# EAGLE design RH022.1 (EAGLE 7.1.0)
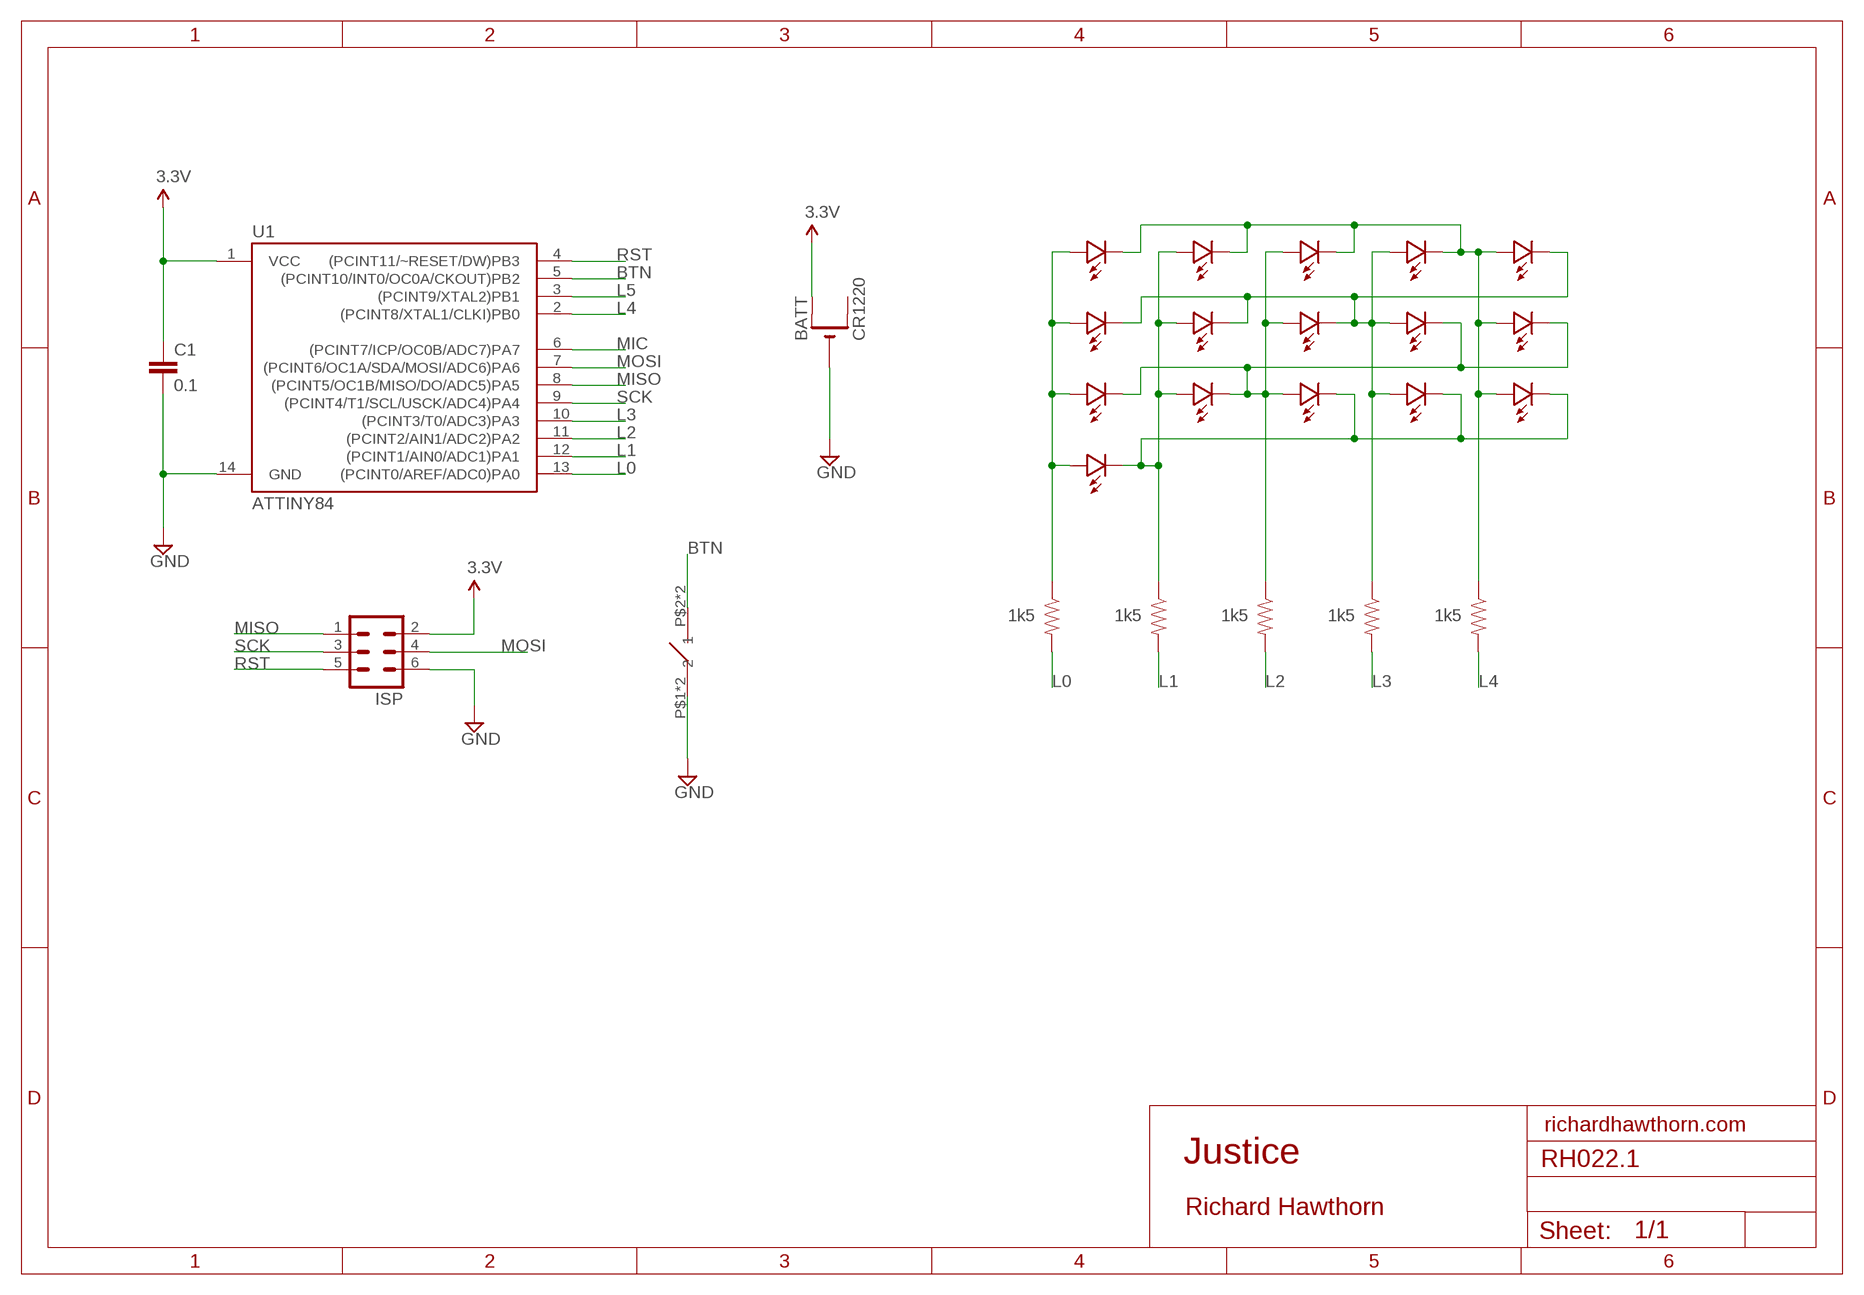
[diagram p0: schematic, sheet 1]

## Parts
BATT  CR1220  CR1220SMT  [CR1220-SMD]
BTN1  TURTLE-3PIN  [TURTLE-3PIN]
C1  0.1  CAP0603-CAP  [0603-CAP]
ISP  MA03-2  [MA03-2]
LED1  LED0603  [0603-LED]
LED2  LED0603  [0603-LED]
LED3  LED0603  [0603-LED]
LED4  LED0603  [0603-LED]
LED5  LED0603  [0603-LED]
LED6  LED0603  [0603-LED]
LED7  LED0603  [0603-LED]
LED8  LED0603  [0603-LED]
LED9  LED0603  [0603-LED]
LED10  LED0603  [0603-LED]
LED11  LED0603  [0603-LED]
LED12  LED0603  [0603-LED]
LED13  LED0603  [0603-LED]
LED14  LED0603  [0603-LED]
LED15  LED0603  [0603-LED]
LED16  LED0603  [0603-LED]
R1  1k5  RESISTOR0603-RES  [0603-RES]
R2  1k5  RESISTOR0603-RES  [0603-RES]
R3  1k5  RESISTOR0603-RES  [0603-RES]
R4  1k5  RESISTOR0603-RES  [0603-RES]
R5  1k5  RESISTOR0603-RES  [0603-RES]
U1  ATTINY84  [SO14]

## Nets
BTN: BTN1.P$2 BTN1.P$4 U1.5((PCINT10/INT0/OC0A/CKOUT)PB2)
GND [power]: BATT.- BTN1.P$1 BTN1.P$3 C1.2 ISP.6 U1.14(GND)
L0: R1.2 U1.13((PCINT0/AREF/ADC0)PA0)
L1: R2.2 U1.12((PCINT1/AIN0/ADC1)PA1)
L2: R3.2 U1.11((PCINT2/AIN1/ADC2)PA2)
L3: R4.2 U1.10((PCINT3/T0/ADC3)PA3)
L4: R5.2 U1.2((PCINT8/XTAL1/CLKI)PB0)
L5: U1.3((PCINT9/XTAL2)PB1)
MIC: U1.6((PCINT7/ICP/OC0B/ADC7)PA7)
MISO: ISP.1 U1.8((PCINT5/OC1B/MISO/DO/ADC5)PA5)
MOSI: ISP.4 U1.7((PCINT6/OC1A/SDA/MOSI/ADC6)PA6)
N$12: LED2.PLUS LED7.PLUS LED12.PLUS LED13.MINUS LED14.MINUS LED15.MINUS LED16.MINUS R2.1
N$22: LED1.PLUS LED6.PLUS LED11.PLUS LED16.PLUS R1.1
N$32: LED1.MINUS LED2.MINUS LED3.MINUS LED4.MINUS LED5.PLUS LED10.PLUS LED15.PLUS R5.1
N$41: LED4.PLUS LED5.MINUS LED6.MINUS LED7.MINUS LED8.MINUS LED9.PLUS LED14.PLUS R4.1
N$50: LED3.PLUS LED8.PLUS LED9.MINUS LED10.MINUS LED11.MINUS LED12.MINUS LED13.PLUS R3.1
RST: ISP.5 U1.4((PCINT11/~RESET/DW)PB3)
SCK: ISP.3 U1.9((PCINT4/T1/SCL/USCK/ADC4)PA4)
VCC: BATT.+$1(+) C1.1 ISP.2 U1.1(VCC) ; supply symbol labelled 3.3V
Unconnected: BATT.+$2(+1)

## Notes on the sheet
- richardhawthorn.com
- Justice
- Richard Hawthorn

## Library data of the parts
BATT = adafruit:CR1220: CR1216/CR1220/CR1225 12mm 3V lithium coin cell Great for battery packup. Both SMT and THM holders. Note the THM package has the ground pads on both sides of the PCB so that the masks are the same - this reduces the cost
BTN1 = Richards:TURTLE-3PIN
C1 = LowPowerLab:CAP: Capacitor Standard 0603 ceramic capacitor, and 0.1" leaded capacitor.
ISP = Richards:MA03-2: PIN HEADER; OC_FARNELL: unknown; OC_NEWARK: unknown
LED1-LED16 = LowPowerLab:LED
R1-R5 = LowPowerLab:RESISTOR: Resistor Basic schematic elements and footprints for 0603, 1206, and PTH resistors.
U1 = SparkFun-DigitalIC:ATTINY84: Atmel 14-pin 2/4/8kB flash uC

## Net classes
1 power: width 0.381 mm, clearance 0.254 mm

## Board
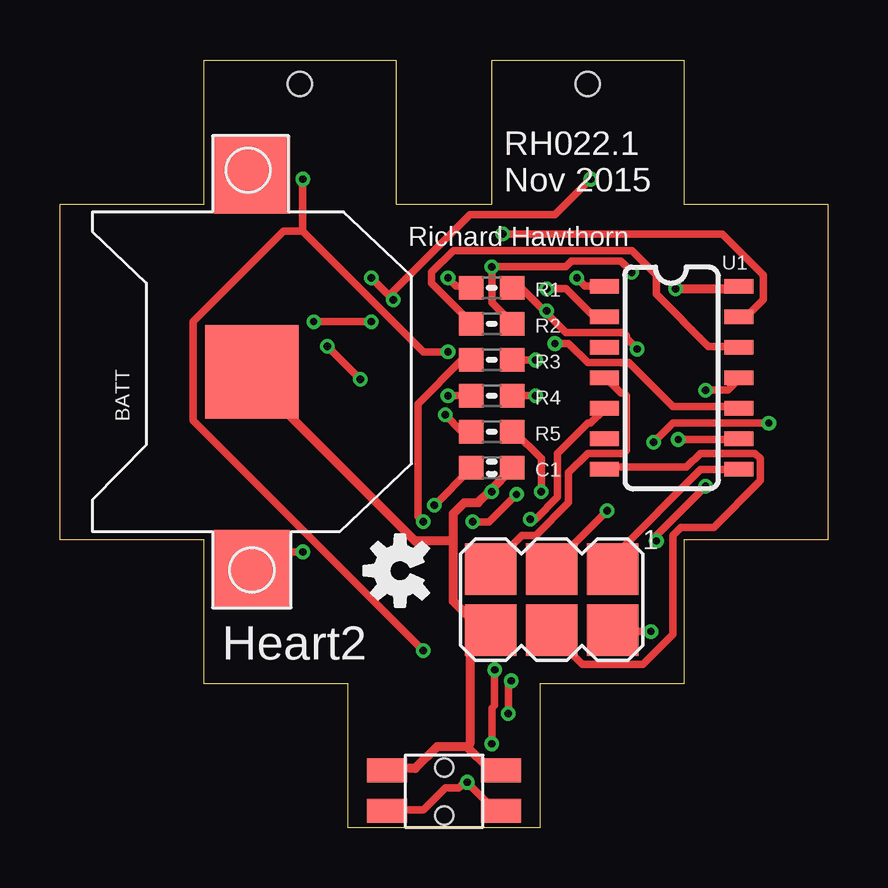
[diagram p1: board, top side]
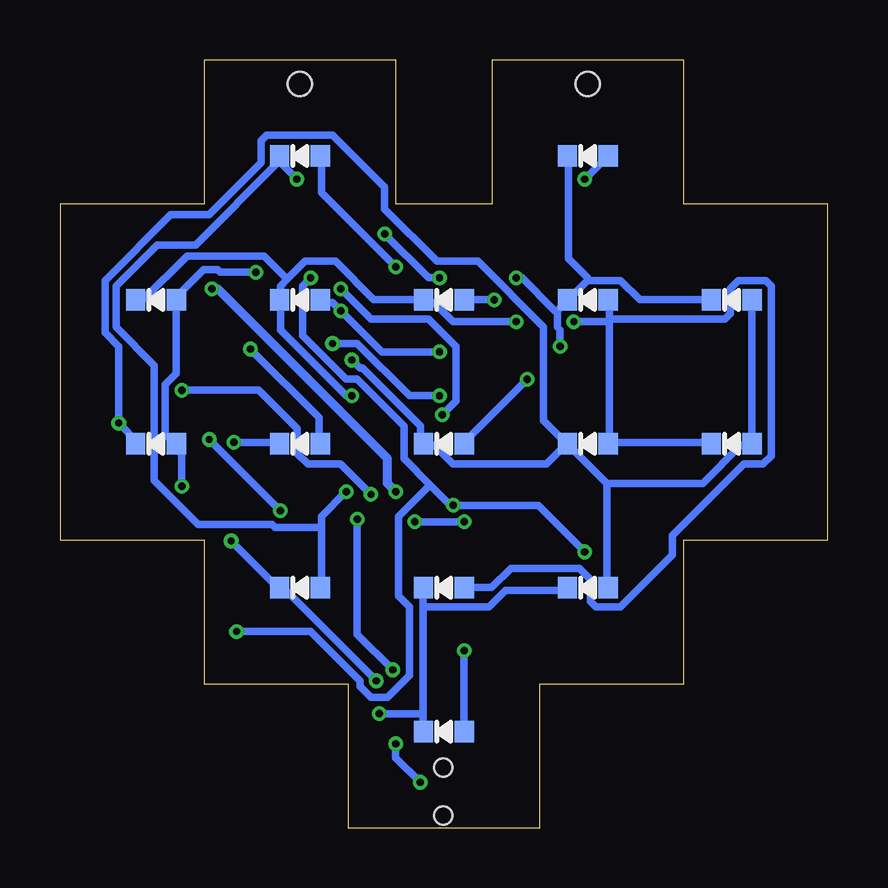
[diagram p2: board, bottom side, seen from below]

Size 32 x 32 mm. Coordinates in mm from the lower left corner, seen from the top.
Outline: 6,26 6,32 14,32 14,26 18,26 18,32 26,32 26,26 32,26 32,12 26,12 26,6 20,6 20,0 12,0 12,6 6,6 6,12 0,12 0,26 6,26
Copper layers (1*16): Top 0.035mm / dielectric 1.5mm / Bottom 0.035mm
Design rules "ITEADstudio_DRC *": minimum track width 12mil, minimum drill 12mil, track to track 6mil, track to pad 6mil, pad to pad 6mil, via to via 6mil, smd to smd 0mil, copper to edge 10mil, drill to drill 10mil, minimum pad ring 10mil, minimum via ring 6mil, stop-mask expansion 2mil, vias tented up to drill 100mil, thermal gap 15mil
Holes 1 mm at 22,31 10,31
tRestrict: area -5.7,-5.1 to -0.9,-1.2; area -24.2,2.9 to -23.1,4.5; area -24.8,-4.3 to -23.3,-3.6
bRestrict: area -2.6,3.7 to -0.8,4.7; area -8.9,-0.2 to -7.1,0.9; area -8.4,-1.4 to -7.9,-0.8; area -9.3,-1.4 to -8.8,-0.8; area -9.8,-1.2 to -9.3,-0.5; area -9.9,-0.6 to -9.4,0; area -3.5,4.9 to -2.9,5.5; area -3.5,3.9 to -2.9,4.5; area -2.5,5.1 to -2,5.8; area -2.1,4.8 to -0.9,5.6

### Footprints (pad centres in the part's own frame; a part is rotated, then mirrored left to right if it is on the bottom)
CR1220-SMD = smd 3.2 x 3.2: +$1 -8.2,0; +$2 8.2,0 | smd 3.9 x 3.9: - 0,0
TURTLE-3PIN = smd 1.676 x 1: P$1 -2.39,-0.889; P$2 -2.39,0.811; P$3 2.36,-0.889; P$4 2.36,0.811 | hole 0.75: -0.015,-1; -0.015,1
0603-CAP = smd 1.016 x 0.965: 1 -0.85,0; 2 0.85,0
MA03-2 = smd 2.159 x 2.159: 1 -2.54,-1.27; 2 -2.54,1.27; 3 0,-1.27; 4 0,1.27; 5 2.54,-1.27; 6 2.54,1.27
0603-LED = smd 0.8 x 0.9: MINUS -0.85,0; PLUS 0.85,0
0603-RES = smd 1.016 x 0.965: 1 -0.85,0; 2 0.85,0
SO14 = smd 0.6 x 1.2: 1 -3.81,-2.8; 2 -2.54,-2.8; 3 -1.27,-2.8; 4 0,-2.8; 5 1.27,-2.8; 6 2.54,-2.8; 7 3.81,-2.8; 8 3.81,2.8; 9 2.54,2.8; 10 1.27,2.8; 11 0,2.8; 12 -1.27,2.8; 13 -2.54,2.8; 14 -3.81,2.8

### Placement (x,y rotation side)
BATT  8,19 90 top
BTN1  16,1.5 180 top
C1  18,15 0 top
ISP  20.5,9.5 180 top
LED1  10,28 0 bottom
LED2  22,28 0 bottom
LED3  4,22 0 bottom
LED4  10,22 0 bottom
LED5  16,22 0 bottom
LED6  22,22 0 bottom
LED7  28,22 0 bottom
LED8  4,16 0 bottom
LED9  10,16 0 bottom
LED10  16,16 0 bottom
LED11  22,16 0 bottom
LED12  28,16 0 bottom
LED13  10,10 0 bottom
LED14  16,10 0 bottom
LED15  22,10 0 bottom
LED16  16,4 0 bottom
R1  18,22.5 180 top
R2  18,21 180 top
R3  18,19.5 180 top
R4  18,18 180 top
R5  18,16.5 180 top
U1  25.5,18.75 270 top
U$3  [OSHW-LOGO-S]  14.17,10.71 90 top

### Tracks (layer width: path | path; a pad name or v marks a point on that pad's centre or on a via)
BTN  (via drill 0.3)
  Top 0.305: v19.61,12.86 19.84,12.86 20.75,13.77 20.75,15.6 22.01,16.86 22.12,16.86 22.69,17.43 U1.5 | v18.12,6.57 18.12,5.09 18.01,4.97 v18.01,3.49 | BTN1.P$2 18.35,0.74 18.12,0.74 v16.98,1.89 16.86,1.89 16.63,1.66 16.06,1.66 15.15,0.74 13.66,0.74 BTN1.P$4
  Bottom 0.305: v19.61,12.86 19.61,8.06 v18.12,6.57 | v18.01,3.49 18.01,2.92 v16.98,1.89
GND  (via drill 0.3)
  Top 0.381: 16.98,3.37 15.72,3.37 14.81,2.46 13.66,2.46 BTN1.P$3 | 16.98,3.37 17.89,2.46 18.35,2.46 BTN1.P$1 | 17.95,14.06 17.43,13.55 16.86,13.55 16.41,13.09 16.41,11.95 | 17.95,14.06 18.81,14.92 C1.2 | 16.41,11.95 16.41,9.43 17.55,8.29 17.89,8.29 ISP.6 17.43,8.17 17.09,7.83 17.09,3.49 16.98,3.37 | v25.66,22.46 28.29,22.46 U1.14 | v18.01,14 17.95,14.06 | 16.41,11.95 14.81,11.95 8.06,18.69 8.06,18.92 BATT.-
  Bottom 0.381: v25.66,22.46 25.44,22.46 18.35,15.38 18.35,14.35 v18.01,14
L0  (via drill 0.3)
  Top 0.305: v16.18,22.92 16.52,22.58 17.09,22.58 R1.2 | v18.46,24.75 27.61,24.75 29.32,23.03 29.32,22.01 28.64,21.32 28.41,21.32 U1.13
  Bottom 0.305: v16.18,22.92 16.63,22.92 v18.46,24.75
L1
  Top 0.305: R2.2 17.09,21.09 15.49,22.69 15.49,23.15 16.41,24.06 23.84,24.06 24.86,23.03 24.86,22.23 27.04,20.06 28.29,20.06 U1.12
L2  (via drill 0.3)
  Top 0.305: v15.15,12.75 14.92,12.98 14.92,17.66 16.75,19.49 17.09,19.49 R3.2 | v17.21,12.75 17.89,12.75 v19.03,13.89 | v26.92,18.23 27.84,18.23 28.29,18.69 U1.11
  Bottom 0.305: v17.21,12.75 v15.15,12.75 | v19.03,13.89 20.29,15.15 21.66,15.15 22.12,15.6 22.12,16.63 23.72,18.23 v26.92,18.23
L3  (via drill 0.3)
  Top 0.305: v16.18,18 17.09,18 R4.2 | v20.63,20.18 21.21,20.18 22.01,19.38 23.72,19.38 25.55,17.55 28.29,17.55 U1.10
  Bottom 0.305: v16.18,18 17.43,18 19.61,20.18 v20.63,20.18
L4  (via drill 0.3)
  Top 0.305: v16.06,17.2 16.75,16.52 17.09,16.52 R5.2 | v20.29,22.46 21.09,22.46 22.23,21.32 22.69,21.32 U1.2
  Bottom 0.305: v16.06,17.2 15.49,17.77 15.49,20.06 16.63,21.2 19.03,21.2 v20.29,22.46
MISO
  Top 0.305: U1.8 28.29,14.92 26.69,14.92 23.15,11.38 23.15,10.8 ISP.1
MOSI
  Top 0.305: U1.7 22.81,15.03 26.12,15.03 26.69,15.6 28.98,15.6 29.21,15.38 29.21,14.46 27.26,12.52 25.89,12.52 25.55,12.18 25.55,8.06 24.29,6.8 21.78,6.8 20.41,8.17 ISP.4
N$12  (via drill 0.3)
  Top 0.305: R2.1 18.81,21.09 18.01,21.89 v18.01,23.38 21.09,23.38 21.32,23.6 23.38,23.6 v23.84,23.15 | v24.86,11.95 24.86,12.18 v26.92,14.23 | v18.69,4.75 18.69,6 v18.81,6.12
  Bottom 0.305: 16.86,9.2 16.86,9.89 LED14.MINUS | 16.86,9.2 16.86,4.75 | 16.86,4.75 16.86,4.06 LED16.MINUS | 16.86,9.2 14.12,9.2 13.43,9.89 10.92,9.89 LED13.MINUS | v18.01,23.38 21.09,26.46 21.09,27.95 LED2.PLUS | v24.86,11.95 22.92,10 LED15.MINUS 22.81,10.12 v18.81,6.12 | v26.92,14.23 26.92,15.72 27.15,15.95 LED12.PLUS 27.26,16.06 27.61,16.4 27.61,18.46 27.15,18.92 LED7.PLUS 27.15,22.12 26.01,23.26 25.44,23.26 25.32,23.15 v23.84,23.15 | v18.69,4.75 16.86,4.75
N$22  (via drill 0.3)
  Top 0.305: v24.06,19.95 23.61,20.4 23.61,20.52 23.49,20.63 21.09,20.63 20.23,21.49 | 20.23,21.49 19.26,22.46 18.92,22.46 R1.1 | 10.12,24.86 v10.12,27.03 | 10.12,24.86 15.15,19.83 v16.18,19.83 | v15.15,7.37 5.55,16.98 5.55,21.09 9.32,24.86 10.12,24.86 | v20.29,21.55 20.23,21.49
  Bottom 0.305: v24.06,19.95 21.21,17.09 21.21,16.06 LED11.PLUS | v10.12,27.03 9.2,27.95 LED1.PLUS | v16.18,19.83 18.58,19.83 v20.29,21.55 20.63,21.89 21.09,21.89 LED6.PLUS | v15.15,7.37 15.15,4.06 LED16.PLUS
N$32  (via drill 0.3)
  Top 0.305: v11.15,20.06 v12.52,18.69 | v12.98,22.92 v13.89,22.01 13.78,22.23 17.09,25.55 20.63,25.55 v22.12,27.03 | v20.06,14 20.06,15.38 18.92,16.52 R5.1
  Bottom 0.305: 10.01,22.8 8.63,22.8 7.83,22.01 LED3.MINUS | 10.01,22.8 10.8,22.01 LED4.MINUS 10.92,21.89 11.26,21.55 | v12.52,18.69 15.15,16.06 LED10.PLUS | v11.15,20.06 11.15,20.75 11.26,20.86 11.26,21.55 | v13.89,22.01 LED5.PLUS | v12.98,22.92 12.75,22.92 11.38,21.55 11.26,21.55 | LED1.MINUS 10.8,27.95 10.8,23.72 10.01,22.92 10.01,22.8 | 21.09,12.52 21.09,12.98 v20.06,14 | 21.09,12.52 21.09,10 LED15.PLUS | 21.09,12.52 23.03,12.52 23.15,12.63 26.24,12.63 28.06,14.46 28.06,19.26 29.66,20.86 29.66,22.58 27.95,24.29 26.35,24.29 22.92,27.72 22.92,27.95 LED2.MINUS 22.81,27.72 v22.12,27.03
N$41  (via drill 0.3)
  Top 0.305: v19.84,18 18.92,18 R4.1 | v10.58,21.09 v12.98,21.09
  Bottom 0.305: 22.52,22.86 22.81,22.58 22.81,22.01 LED6.MINUS 22.81,21.89 22.81,20.75 20.06,18 v19.84,18 | 22.52,22.86 21.78,23.6 20.52,23.6 18.92,22.01 16.86,22.01 LED5.MINUS 16.75,21.89 16.41,21.89 15.61,21.09 v12.98,21.09 | 22.52,22.86 23.49,23.83 26.69,23.83 28.52,22.01 28.75,22.01 LED7.MINUS | LED8.MINUS 4.86,16.06 9.09,16.06 LED9.PLUS 9.09,16.18 9.09,21.09 | 9.09,21.09 9.09,21.2 | 9.09,21.2 9.09,21.89 LED4.PLUS | 9.09,21.2 4.29,21.2 4.06,21.43 4.06,22.46 3.72,22.8 2.58,22.8 2.35,22.58 2.35,15.49 2.69,15.15 3.49,15.15 6.46,12.18 6.46,11.38 8.63,9.2 9.66,9.2 9.89,9.43 9.89,10.35 10.35,10.8 13.2,10.8 14.01,10 LED14.PLUS | 9.09,21.09 v10.58,21.09
N$50  (via drill 0.3)
  Top 0.305: v24.75,16.06 25.55,16.86 v29.55,16.86 | v19.84,19.49 18.92,19.49 R3.1
  Bottom 0.305: v24.75,16.06 22.92,16.06 LED11.MINUS | LED12.MINUS 28.75,16.06 v29.55,16.86 29.55,20.06 30.12,20.63 30.12,22.8 27.38,25.55 25.78,25.55 23.61,27.72 23.61,28.63 23.38,28.86 20.63,28.86 18.46,26.69 18.46,25.78 16.29,23.6 14.58,23.6 11.83,20.86 11.83,16.98 10.92,16.06 LED9.MINUS | LED3.PLUS 3.15,21.89 3.15,16.06 LED8.PLUS 3.26,15.95 3.6,15.95 5.2,14.35 9.2,14.35 | 9.2,14.35 9.2,10 LED13.PLUS | 9.2,14.35 10.8,15.95 LED9.MINUS | LED9.MINUS 10.92,15.95 11.72,15.15 15.61,15.15 16.41,15.95 16.75,15.95 LED10.MINUS 16.98,16.06 16.98,16.75 19.38,19.15 19.49,19.15 v19.84,19.49
RST
  Top 0.305: U1.4 22.81,18.69 23.38,18.12 23.49,18.12 23.61,18 23.61,15.72 23.49,15.6 22.01,15.6 21.21,14.8 21.21,13.55 19.84,12.18 19.26,12.18 17.89,10.8 ISP.5
SCK  (via drill 0.3)
  Top 0.305: v25.78,16.18 28.29,16.18 U1.9 | v22.81,13.2 20.41,10.8 ISP.3
  Bottom 0.305: v22.81,13.2 v25.78,16.18
VCC  (via drill 0.3)
  Top 0.305: v15.61,13.43 17.09,14.92 C1.1 | v10.12,11.49 8.75,11.49 8.06,10.8 BATT.+$1 | v21.55,22.92 21.89,22.58 22.69,22.58 U1.1 | v24.63,8.17 23.15,8.17 ISP.2
  Bottom 0.305: v10.12,11.49 12.06,13.43 v15.61,13.43 15.72,13.43 16.58,14.29 | v21.55,22.92 21.89,22.58 21.89,20.52 20.06,18.69 19.61,18.69 17.66,16.75 17.66,15.38 16.58,14.29 | v24.63,8.17 21.55,8.17 19.49,6.12 19.49,5.89 19.03,5.43 18.35,5.43 17.43,6.34 17.43,9.2 17.89,9.66 17.89,12.98 16.58,14.29

### Text on the board
tNames: RH022.1 / Nov 2015 | Richard Hawthorn | Heart2
tDocu: REG